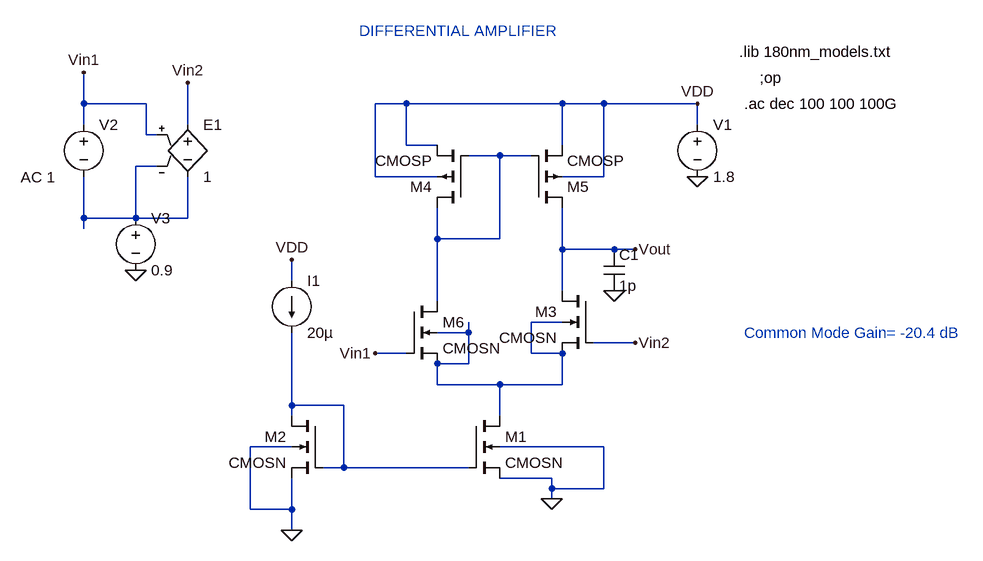
[diagram p0: schematic final_cmaic.asc]
final_cmaic.asc, the LTspice schematic file:
Version 4
SHEET 1 1184 680
WIRE -224 0 -224 -48
WIRE -128 0 -224 0
WIRE 272 0 224 0
WIRE 512 0 272 0
WIRE 576 0 512 0
WIRE 720 0 576 0
WIRE -224 32 -224 0
WIRE -64 32 -64 -32
WIRE 720 32 720 0
WIRE -128 48 -128 0
WIRE -112 48 -128 48
WIRE 272 64 272 0
WIRE 320 64 272 64
WIRE 512 64 512 0
WIRE 416 80 368 80
WIRE 464 80 416 80
WIRE -112 96 -144 96
WIRE 224 112 224 0
WIRE 320 112 224 112
WIRE 576 112 576 0
WIRE 576 112 512 112
WIRE -224 176 -224 112
WIRE -144 176 -144 96
WIRE -144 176 -224 176
WIRE -64 176 -64 112
WIRE -64 176 -144 176
WIRE -224 192 -224 176
WIRE 320 208 320 160
WIRE 416 208 416 80
WIRE 416 208 320 208
WIRE 512 224 512 160
WIRE 592 224 512 224
WIRE 624 224 592 224
WIRE 96 272 96 240
WIRE 512 288 512 224
WIRE 320 304 320 208
WIRE 512 336 464 336
WIRE 368 352 368 336
WIRE 368 352 320 352
WIRE 624 368 560 368
WIRE 272 384 224 384
WIRE 464 384 464 336
WIRE 512 384 464 384
WIRE 320 400 320 384
WIRE 368 400 368 352
WIRE 368 400 320 400
WIRE 320 432 320 400
WIRE 416 432 320 432
WIRE 512 432 512 384
WIRE 512 432 416 432
WIRE 96 464 96 352
WIRE 176 464 96 464
WIRE 96 480 96 464
WIRE 416 480 416 432
WIRE 96 528 32 528
WIRE 576 528 416 528
WIRE 176 560 176 464
WIRE 176 560 144 560
WIRE 368 560 176 560
WIRE 496 576 416 576
WIRE 496 592 496 576
WIRE 576 592 576 528
WIRE 576 592 496 592
WIRE 496 608 496 592
WIRE 32 624 32 528
WIRE 96 624 96 576
WIRE 96 624 32 624
WIRE 96 656 96 624
FLAG -144 256 0
FLAG 624 368 Vin2
FLAG -64 -32 Vin2
FLAG -224 -48 Vin1
FLAG 720 112 0
FLAG 624 224 Vout
FLAG 224 384 Vin1
FLAG 96 656 0
FLAG 496 608 0
FLAG 720 0 VDD
FLAG 96 240 VDD
FLAG 592 288 0
SYMBOL voltage 720 16 R0
WINDOW 123 0 0 Left 0
WINDOW 39 0 0 Left 0
SYMATTR InstName V1
SYMATTR Value 1.8
SYMBOL voltage -224 16 R0
WINDOW 123 -97 97 Left 2
WINDOW 39 0 0 Left 0
SYMATTR Value2 AC 1
SYMATTR InstName V2
SYMATTR Value ""
SYMBOL voltage -144 160 R0
WINDOW 123 0 0 Left 0
WINDOW 39 0 0 Left 0
SYMATTR InstName V3
SYMATTR Value 0.9
SYMBOL current 96 272 R0
WINDOW 123 0 0 Left 0
WINDOW 39 0 0 Left 0
SYMATTR InstName I1
SYMATTR Value 20µ
SYMBOL e -64 16 R0
SYMATTR InstName E1
SYMATTR Value 1
SYMBOL cmosn 368 480 R0
SYMATTR InstName M1
SYMATTR Value2 l=0.5u w=2u m=2
SYMBOL cmosn 144 480 M0
SYMATTR InstName M2
SYMATTR Value2 l=0.5u w=1u m=1
SYMBOL cmosn 560 288 M0
SYMATTR InstName M3
SYMATTR Value2 l=0.5u w=2u m=2
SYMBOL cmosp 368 160 R180
SYMATTR InstName M4
SYMATTR Value2 l=0.5u w=2u m=2
SYMBOL cmosp 464 160 M180
SYMATTR InstName M5
SYMATTR Value2 l=0.5u w=2u m=2
SYMBOL cmosn 272 304 R0
SYMATTR InstName M6
SYMATTR Value2 l=0.5u w=2u m=2
SYMBOL cap 576 224 R0
SYMATTR InstName C1
SYMATTR Value 1p
TEXT 816 -40 Left 2 !;op
TEXT 784 -80 Left 2 !.lib 180nm_models.txt
TEXT 200 -112 Left 2 ;DIFFERENTIAL AMPLIFIER
TEXT 792 0 Left 2 !.ac dec 100 100 100G
TEXT 792 352 Left 2 ;Common Mode Gain= -20.4 dB

The netlist it stands for:
* final_cmaic.asc
V1 VDD 0 1.8
V2 Vin1 N002 AC 1
V3 N002 0 0.9
I1 VDD N004 20µ
E1 Vin2 N002 Vin1 N002 1
M1 N003 N004 0 0 CMOSN l=0.5u w=2u m=2
M2 N004 N004 0 0 CMOSN l=0.5u w=1u m=1
M3 Vout Vin2 N003 N003 CMOSN l=0.5u w=2u m=2
M4 N001 N001 VDD VDD CMOSP l=0.5u w=2u m=2
M5 Vout N001 VDD VDD CMOSP l=0.5u w=2u m=2
M6 N001 Vin1 N003 N003 CMOSN l=0.5u w=2u m=2
C1 Vout 0 1p
.model NMOS NMOS
.model PMOS PMOS
.lib standard.mos
;op
.lib 180nm_models.txt
* DIFFERENTIAL AMPLIFIER
.ac dec 100 100 100G
* Common Mode Gain= -20.4 dB
.backanno
.end